# EAGLE design miniDCU main (EAGLE 9.6.2)
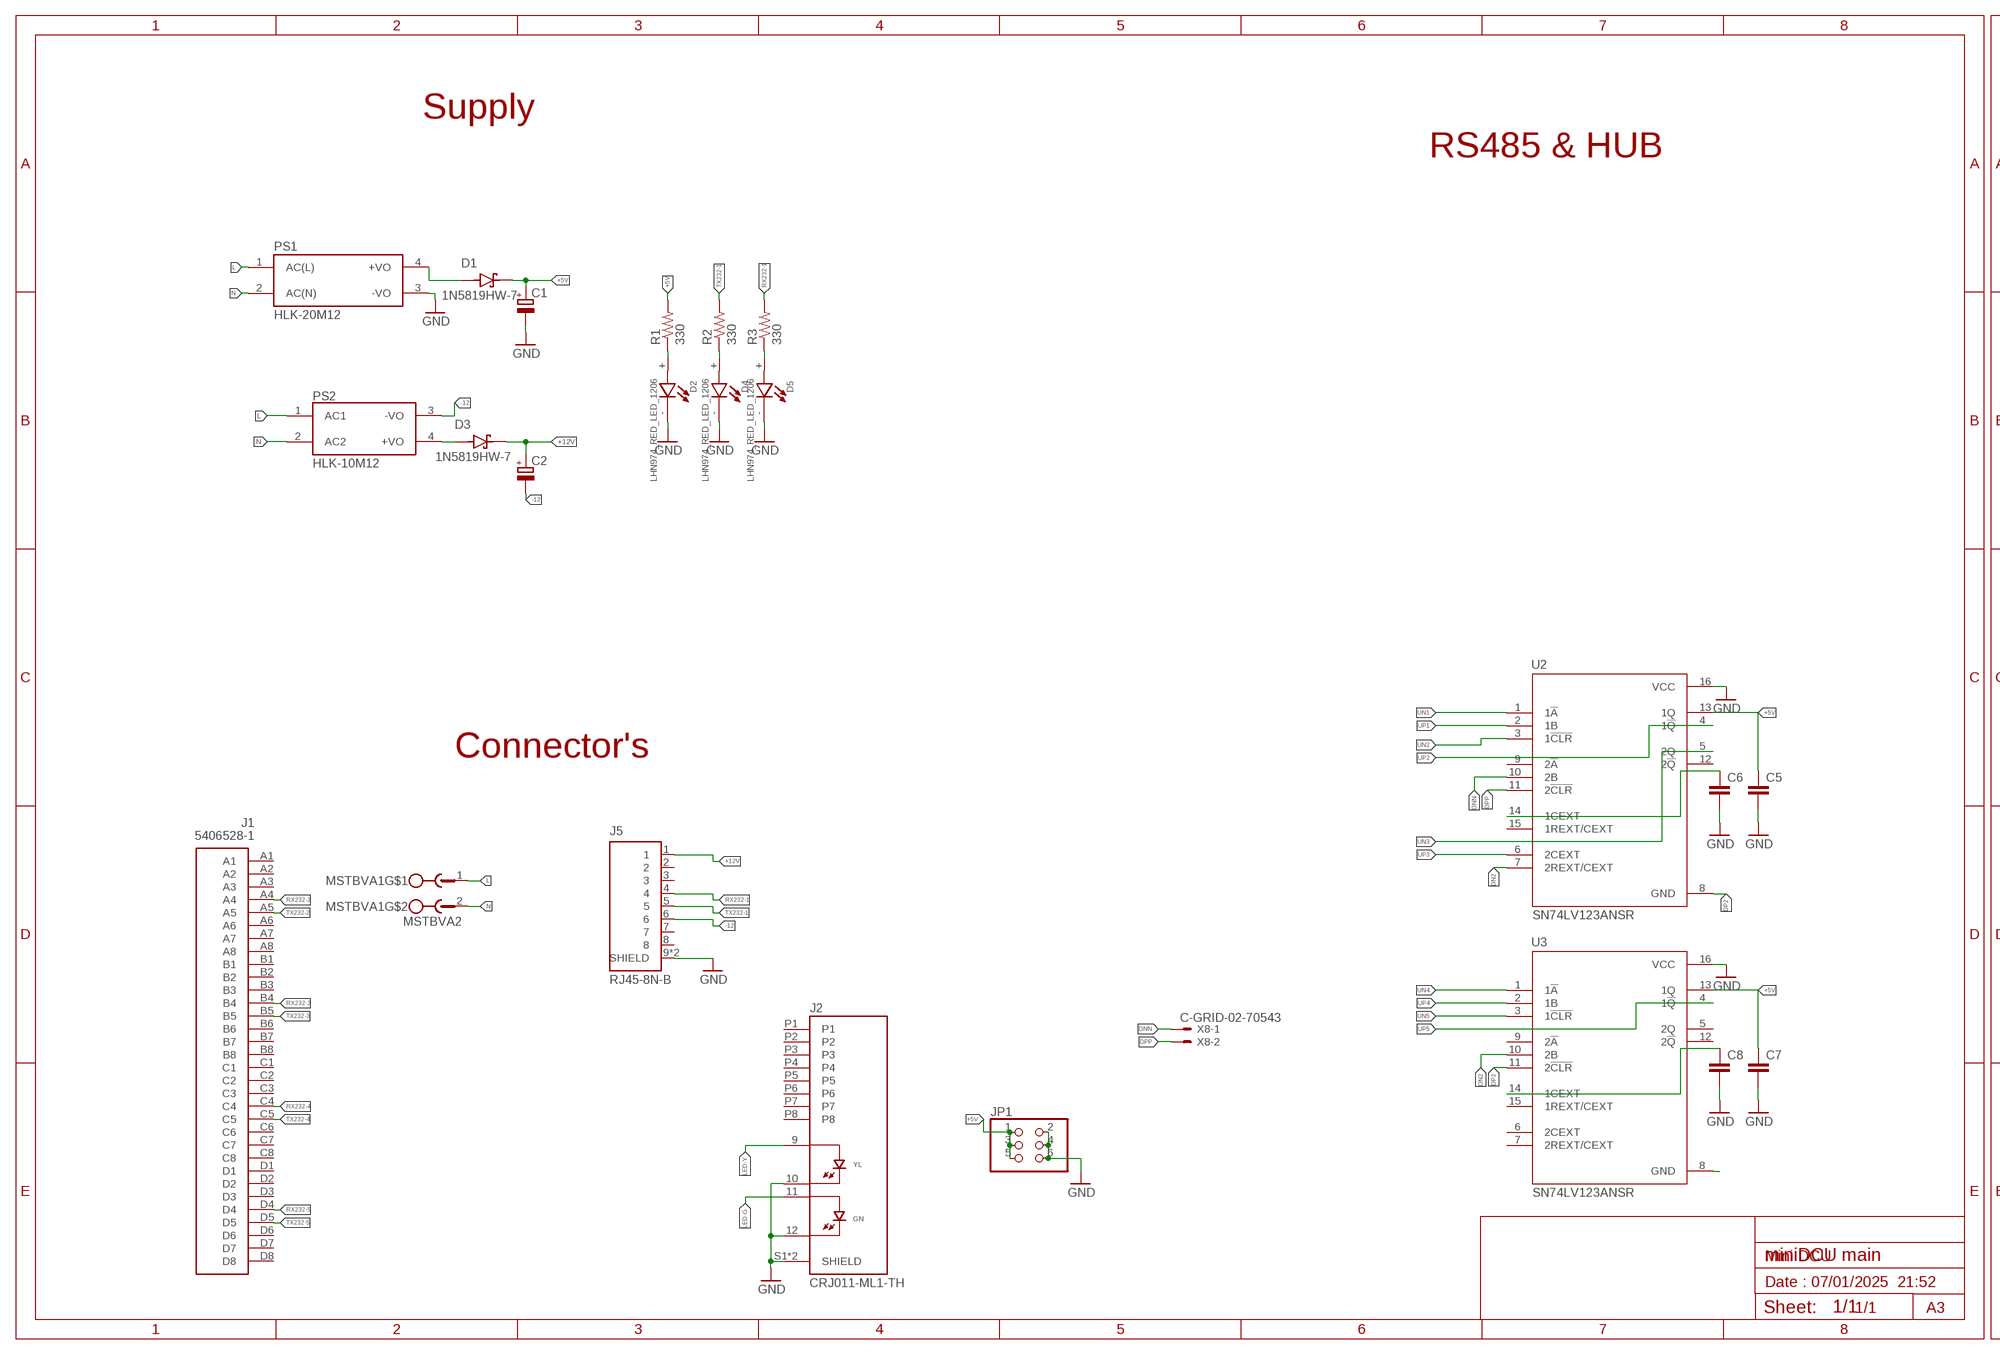
[diagram p0: schematic, sheet 1, part 1 of 2]
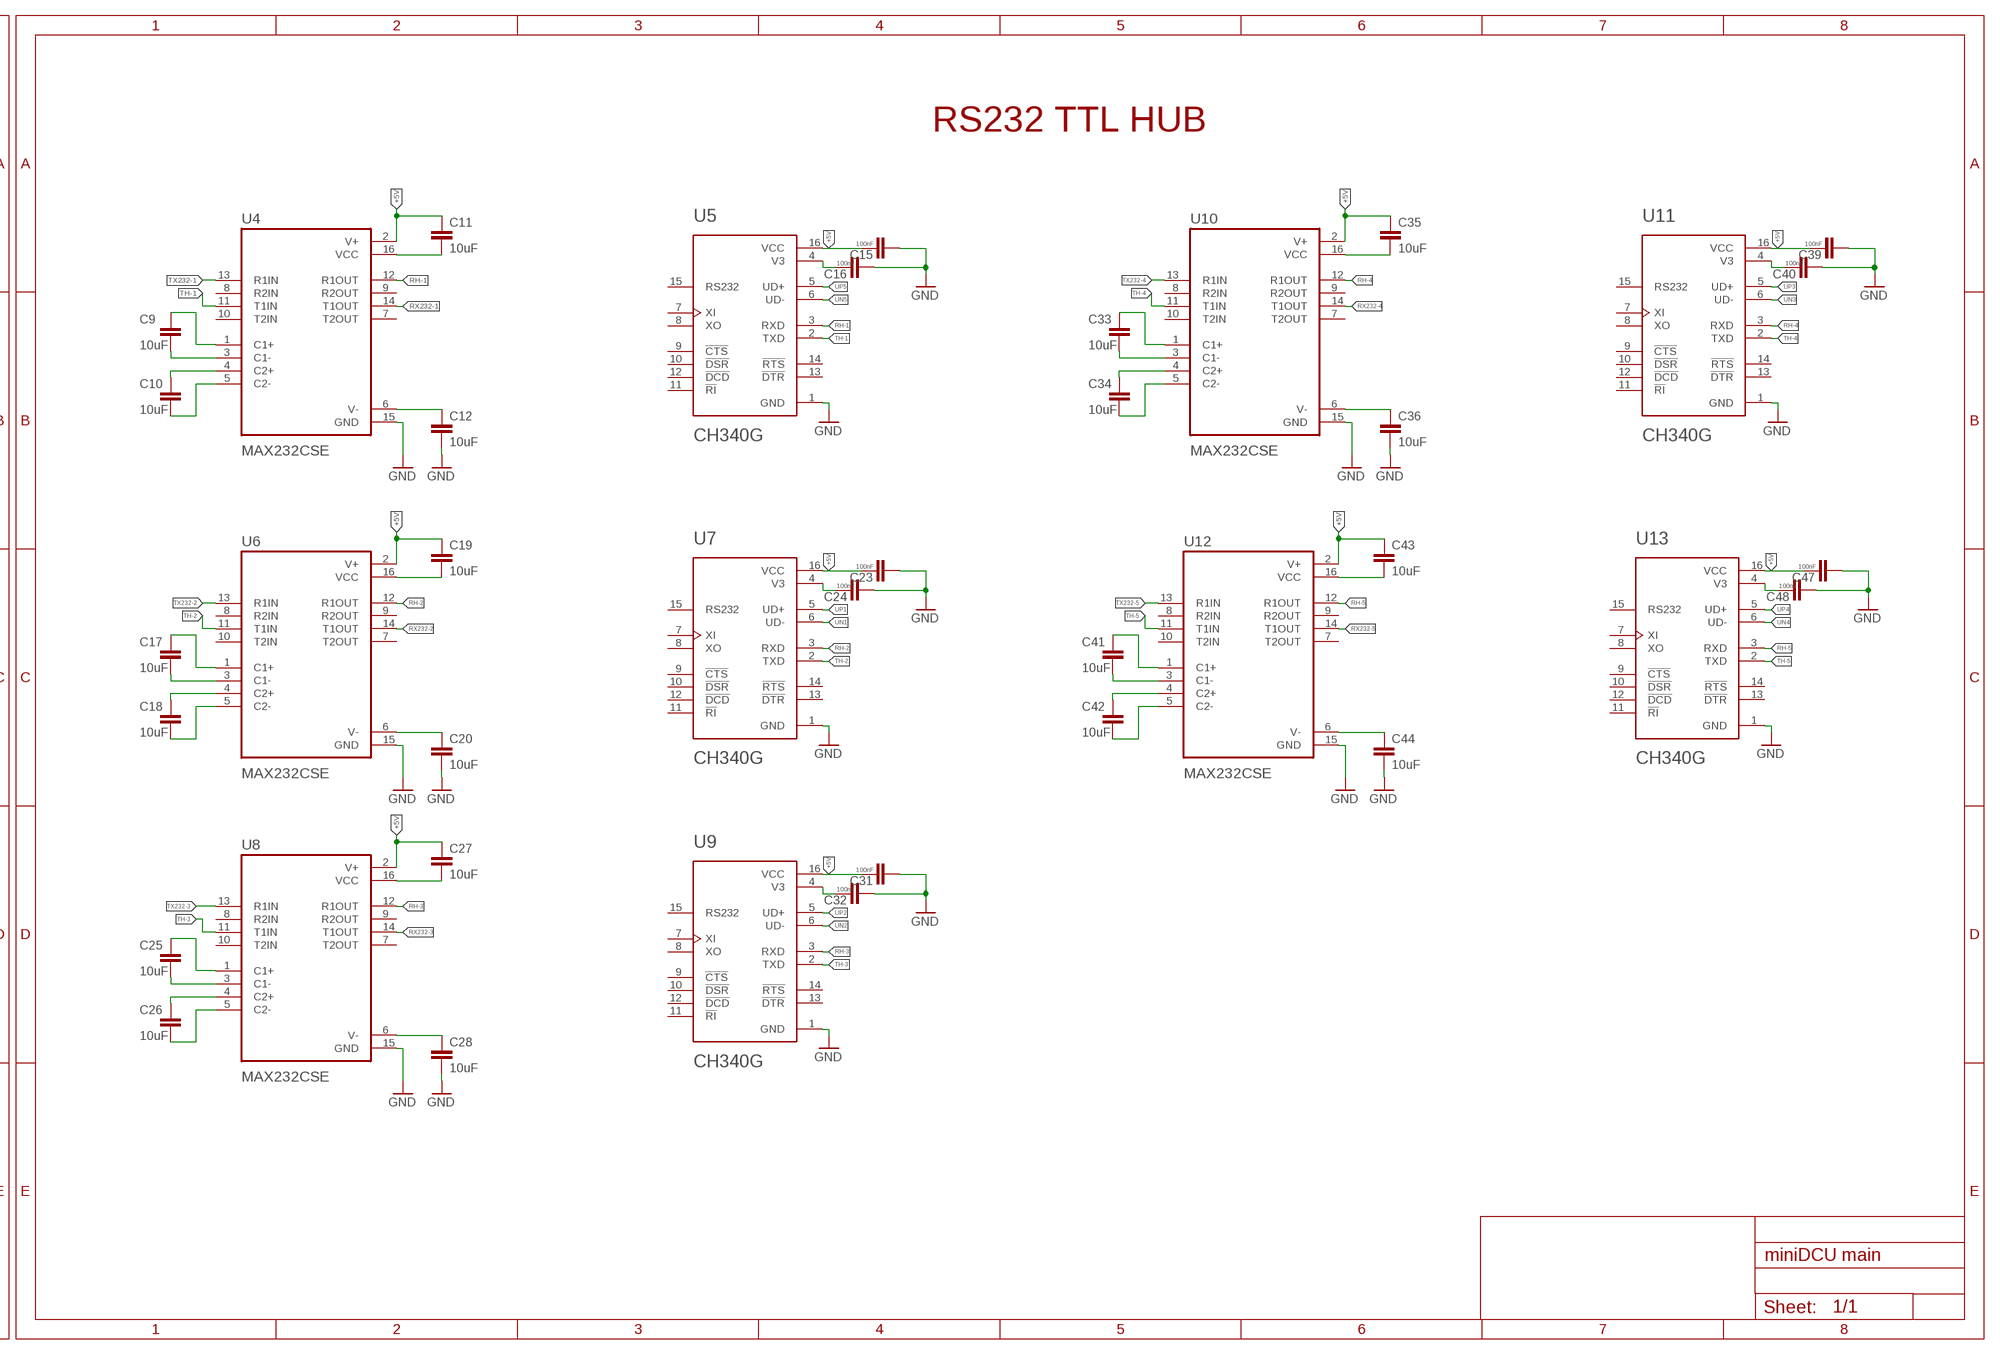
[diagram p1: schematic, sheet 1, part 2 of 2]

## Parts
C1  CPOL-EU153CLV-0505  [153CLV-0505]
C2  CPOL-EU153CLV-0505  [153CLV-0505]
C5  C-EUC0603K  [C0603K]
C6  C-EUC0603K  [C0603K]
C7  C-EUC0603K  [C0603K]
C8  C-EUC0603K  [C0603K]
C9  10uF  C-EUC0805  [C0805]
C10  10uF  C-EUC0805  [C0805]
C11  10uF  C-EUC0805  [C0805]
C12  10uF  C-EUC0805  [C0805]
C15  100nF  C-EUC0805K  [C0805K]
C16  100nF  C-EUC0805K  [C0805K]
C17  10uF  C-EUC0805  [C0805]
C18  10uF  C-EUC0805  [C0805]
C19  10uF  C-EUC0805  [C0805]
C20  10uF  C-EUC0805  [C0805]
C23  100nF  C-EUC0805K  [C0805K]
C24  100nF  C-EUC0805K  [C0805K]
C25  10uF  C-EUC0805  [C0805]
C26  10uF  C-EUC0805  [C0805]
C27  10uF  C-EUC0805  [C0805]
C28  10uF  C-EUC0805  [C0805]
C31  100nF  C-EUC0805K  [C0805K]
C32  100nF  C-EUC0805K  [C0805K]
C33  10uF  C-EUC0805  [C0805]
C34  10uF  C-EUC0805  [C0805]
C35  10uF  C-EUC0805  [C0805]
C36  10uF  C-EUC0805  [C0805]
C39  100nF  C-EUC0805K  [C0805K]
C40  100nF  C-EUC0805K  [C0805K]
C41  10uF  C-EUC0805  [C0805]
C42  10uF  C-EUC0805  [C0805]
C43  10uF  C-EUC0805  [C0805]
C44  10uF  C-EUC0805  [C0805]
C47  100nF  C-EUC0805K  [C0805K]
C48  100nF  C-EUC0805K  [C0805K]
D1  1N5819HW-7  [SOD3715X145N]
D2  LHN974_RED_LED_1206  [LEDC3216X120N]
D3  1N5819HW-7  [SOD3715X145N]
D4  LHN974_RED_LED_1206  [LEDC3216X120N]
D5  LHN974_RED_LED_1206  [LEDC3216X120N]
J1  5406528-1  [5406528-1]
J2  CRJ011-ML1-TH  [CUI_CRJ011-ML1-TH]
J5  RJ45-8N-B  [TE_RJ45-8N-B]
JP1  PINHD-2X3  [2X03]
MSTBVA1  MSTBVA2  [MSTBVA2]
PS1  HLK-20M12  [CONV_HLK-20M12]
PS2  HLK-10M12  [CONV_HLK-10M12]
R1  330  R-US_M0805  [M0805]
R2  330  R-US_M0805  [M0805]
R3  330  R-US_M0805  [M0805]
U2  SN74LV123ANSR  [SOIC127P780X200-16N]
U3  SN74LV123ANSR  [SOIC127P780X200-16N]
U4  MAX232CSE  [SOIC127P600X175-16N]
U5  CH340G  [SOIC127P600X180-16N]
U6  MAX232CSE  [SOIC127P600X175-16N]
U7  CH340G  [SOIC127P600X180-16N]
U8  MAX232CSE  [SOIC127P600X175-16N]
U9  CH340G  [SOIC127P600X180-16N]
U10  MAX232CSE  [SOIC127P600X175-16N]
U11  CH340G  [SOIC127P600X180-16N]
U12  MAX232CSE  [SOIC127P600X175-16N]
U13  CH340G  [SOIC127P600X180-16N]
X8  C-GRID-02-70543  [70543-02]

## Nets
+5V: C1.+ C5.1 C7.1 C11.1 C15.1 C19.1 C23.1 C27.1 C31.1 C35.1 C39.1 C43.1 C47.1 D1.C(K) JP1.1 JP1.3 JP1.5 R1.2 U2.13(1Q) U3.13(1Q) U4.2(V+) U5.16(VCC) U6.2(V+) U7.16(VCC) U8.2(V+) U9.16(VCC) U10.2(V+) U11.16(VCC) U12.2(V+) U13.16(VCC)
+12V: C2.+ D3.C(K) J5.1
-12: C2.- J5.6 PS2.3(-VO)
DN2: U2.7(2REXT/CEXT) U3.10(2B)
DNN: U2.10(2B) X8.1
DP2: U2.8(GND) U3.11(2!CLR)
DPP: U2.11(2!CLR) X8.2
GND: C1.- C5.2 C6.2 C7.2 C8.2 C12.2 C15.2 C16.2 C20.2 C23.2 C24.2 C28.2 C31.2 C32.2 C36.2 C39.2 C40.2 C44.2 C47.2 C48.2 D2.- D4.- D5.- J2.10 J2.12 J2.S1(SHIELD) J2.S2(SHIELD) J5.9(SHIELD) J5.10(SHIELD) JP1.2 JP1.4 JP1.6 PS1.3(-VO) U2.16(VCC) U3.16(VCC) U4.15(GND) U5.1(GND) U6.15(GND) U7.1(GND) U8.15(GND) U9.1(GND) U10.15(GND) U11.1(GND) U12.15(GND) U13.1(GND)
L: MSTBVA1.1 PS1.1(AC(L)) PS2.1(AC1)
LED-G: J2.11
LED-Y: J2.9
N: MSTBVA1.2 PS1.2(AC(N)) PS2.2(AC2)
N$1: D1.A PS1.4(+VO)
N$2: D4.+ R2.1
N$3: D2.+ R1.1
N$4: D5.+ R3.1
N$8: D3.A PS2.4(+VO)
N$13: U3.8(GND)
N$14: C9.2 U4.3(C1-)
N$15: C9.1 U4.1(C1+)
N$16: C10.1 U4.4(C2+)
N$17: C10.2 U4.5(C2-)
N$18: C11.2 U4.16(VCC)
N$19: C12.1 U4.6(V-)
N$27: C16.1 U5.4(V3)
N$29: C17.2 U6.3(C1-)
N$30: C17.1 U6.1(C1+)
N$31: C18.1 U6.4(C2+)
N$32: C18.2 U6.5(C2-)
N$33: C19.2 U6.16(VCC)
N$34: C20.1 U6.6(V-)
N$39: C24.1 U7.4(V3)
N$41: C25.2 U8.3(C1-)
N$42: C25.1 U8.1(C1+)
N$43: C26.1 U8.4(C2+)
N$44: C26.2 U8.5(C2-)
N$45: C27.2 U8.16(VCC)
N$46: C28.1 U8.6(V-)
N$49: C32.1 U9.4(V3)
N$51: C33.2 U10.3(C1-)
N$52: C33.1 U10.1(C1+)
N$53: C34.1 U10.4(C2+)
N$55: C8.1 U3.14(1CEXT)
N$56: C34.2 U10.5(C2-)
N$57: C35.2 U10.16(VCC)
N$58: C36.1 U10.6(V-)
N$61: C6.1 U2.14(1CEXT)
N$62: C40.1 U11.4(V3)
N$64: C41.2 U12.3(C1-)
N$65: C41.1 U12.1(C1+)
N$66: C42.1 U12.4(C2+)
N$67: C42.2 U12.5(C2-)
N$68: C43.2 U12.16(VCC)
N$69: C44.1 U12.6(V-)
N$72: C48.1 U13.4(V3)
RH-1: U4.12(R1OUT) U5.3(RXD)
RH-2: U6.12(R1OUT) U7.3(RXD)
RH-3: U8.12(R1OUT) U9.3(RXD)
RH-4: U10.12(R1OUT) U11.3(RXD)
RH-5: U12.12(R1OUT) U13.3(RXD)
RX232-1: J5.4 R3.2 U4.14(T1OUT)
RX232-2: J1.A4 U6.14(T1OUT)
RX232-3: J1.B4 U8.14(T1OUT)
RX232-4: J1.C4 U10.14(T1OUT)
RX232-5: J1.D4 U12.14(T1OUT)
TH-1: U4.11(T1IN) U5.2(TXD)
TH-2: U6.11(T1IN) U7.2(TXD)
TH-3: U8.11(T1IN) U9.2(TXD)
TH-4: U10.11(T1IN) U11.2(TXD)
TH-5: U12.11(T1IN) U13.2(TXD)
TX232-1: J5.5 R2.2 U4.13(R1IN)
TX232-2: J1.A5 U6.13(R1IN)
TX232-3: J1.B5 U8.13(R1IN)
TX232-4: J1.C5 U10.13(R1IN)
TX232-5: J1.D5 U12.13(R1IN)
UN1: U2.1(1!A) U7.6(UD-)
UN2: U2.3(1!CLR) U9.6(UD-)
UN3: U2.5(2Q) U11.6(UD-)
UN4: U3.1(1!A) U13.6(UD-)
UN5: U3.3(1!CLR) U5.6(UD-)
UP1: U2.2(1B) U7.5(UD+)
UP2: U2.4(1!Q) U9.5(UD+)
UP3: U2.6(2CEXT) U11.5(UD+)
UP4: U3.2(1B) U13.5(UD+)
UP5: U3.4(1!Q) U5.5(UD+)
Unconnected: J1.A1 J1.A2 J1.A3 J1.A6 J1.A7 J1.A8 J1.B1 J1.B2 J1.B3 J1.B6 J1.B7 J1.B8 J1.C1 J1.C2 J1.C3 J1.C6 J1.C7 J1.C8 J1.D1 J1.D2 J1.D3 J1.D6 J1.D7 J1.D8 J2.P1 J2.P2 J2.P3 J2.P4 J2.P5 J2.P6 J2.P7 J2.P8 J5.2 J5.3 J5.7 J5.8 U2.9(2!A) U2.12(2!Q) U2.15(1REXT/CEXT) U3.5(2Q) U3.6(2CEXT) U3.7(2REXT/CEXT) U3.9(2!A) U3.12(2!Q) U3.15(1REXT/CEXT) U4.7(T2OUT) U4.8(R2IN) U4.9(R2OUT) U4.10(T2IN) U5.7(XI) U5.8(XO) U5.9(!CTS) U5.10(!DSR) U5.11(!RI) U5.12(!DCD) U5.13(!DTR) U5.14(!RTS) U5.15(RS232) U6.7(T2OUT) U6.8(R2IN) U6.9(R2OUT) U6.10(T2IN) U7.7(XI) U7.8(XO) U7.9(!CTS) U7.10(!DSR) U7.11(!RI) U7.12(!DCD) U7.13(!DTR) U7.14(!RTS) U7.15(RS232) U8.7(T2OUT) U8.8(R2IN) U8.9(R2OUT) U8.10(T2IN) U9.7(XI) U9.8(XO) U9.9(!CTS) U9.10(!DSR) U9.11(!RI) U9.12(!DCD) U9.13(!DTR) U9.14(!RTS) U9.15(RS232) U10.7(T2OUT) U10.8(R2IN) U10.9(R2OUT) U10.10(T2IN) U11.7(XI) U11.8(XO) U11.9(!CTS) U11.10(!DSR) U11.11(!RI) U11.12(!DCD) U11.13(!DTR) U11.14(!RTS) U11.15(RS232) U12.7(T2OUT) U12.8(R2IN) U12.9(R2OUT) U12.10(T2IN) U13.7(XI) U13.8(XO) U13.9(!CTS) U13.10(!DSR) U13.11(!RI) U13.12(!DCD) U13.13(!DTR) U13.14(!RTS) U13.15(RS232)

## Notes on the sheet
- Supply
- RS232 TTL HUB
- RS485 & HUB
- Connector's
- Mini DCU
- Date : 07/01/2025  21:52
- 1/1 | A3

## Library data of the parts
C1 C2 = rcl:CPOL-EU: POLARIZED CAPACITOR, European symbol; SPICEPREFIX: C
C5-C12 C15-C20 C23-C28 C31-C36 C39-C44 C47 C48 = rcl:C-EU: CAPACITOR, European symbol; SPICEPREFIX: C
D1 D3 = 1N5819HW-7:1N5819HW-7: 1N5819HW Series 40 V 1 A Surface Mount Schottky Barrier Rectifier - SOD-123 Check availability <https://pricing.snapeda.com/parts/1N5819HW-7/Diodes%20Inc./view-part?ref=eda>; AVAILABILITY: In Stock; DESCRIPTION: Diode Schottky 40 V 1A Surface Mount SOD-123; MF: Diodes Inc.; MP: 1N5819HW-7; PACKAGE: SOD-123 Fairchild Semiconductor; PRICE: None; PURCHASE-URL: https://pricing.snapeda.com/search/part/1N5819HW-7/?ref=eda
D2 D4 D5 = LHN974_RED_LED_1206:LHN974_RED_LED_1206: Check availability <https://pricing.snapeda.com/parts/LHN974%20RED%20LED%201206/Osram/view-part?ref=eda>; AVAILABILITY: Not in stock; CHECK_PRICES: https://www.snapeda.com/parts/LHN974%20RED%20LED%201206/Osram/view-part/?ref=eda; DESCRIPTION: 2.6 V Red LED SMD; MF: Osram; MP: LHN974 RED LED 1206; PACKAGE: None; PRICE: None; SNAPEDA_LINK: https://www.snapeda.com/parts/LHN974%20RED%20LED%201206/Osram/view-part/?ref=snap
J1 = 1x4-rj45:5406528-1: https://www.mouser.com/ProductDetail/TE-Connectivity/5406528-1?qs=%2Fha2pyFaduhW1yoX2fqnO8wde0gPlB9ihmIbWroxuIA%3D Check availability <https://pricing.snapeda.com/parts/5406528-1/TE%20Connectivity/view-part?ref=eda>; AVAILABILITY: In Stock; CHECK_PRICES: https://www.snapeda.com/parts/5406528-1/TE+Connectivity+AMP+Connectors/view-part/?ref=eda; COMMENT: 5406528-1; DESCRIPTION: Conn RJ-45 F 32 POS 2.04mm Solder RA Thru-Hole 32 Terminal 4 Port Tray Cat 5; EU_ROHS_COMPLIANCE: Compliant; MF: TE Connectivity; MP: 5406528-1; PACKAGE: None; PRICE: None; SNAPEDA_LINK: https://www.snapeda.com/parts/5406528-1/TE+Connectivity+AMP+Connectors/view-part/?ref=snap
J2 = CRJ011-ML1-TH:CRJ011-ML1-TH: Check availability <https://pricing.snapeda.com/parts/CRJ011-ML1-TH/Same%20Sky/view-part?ref=eda>; AVAILABILITY: In Stock; CHECK_PRICES: https://www.snapeda.com/parts/CRJ011-ML1-TH/Same+Sky/view-part/?ref=eda; DESCRIPTION: 10/100 BaseT, 8P8C, Horizontal, Shielded, LED, Through Hole, 6 µin Plating, RJ45 with Integrated Magnetics Modular Connector; MF: Same Sky; MP: CRJ011-ML1-TH; PACKAGE: None; PRICE: None; SNAPEDA_LINK: https://www.snapeda.com/parts/CRJ011-ML1-TH/Same+Sky/view-part/?ref=snap
J5 = RJ45-8N-B:RJ45-8N-B: RJ Jack / Signal Line EMI/RFI Filters 6 TERM LOW PROFILE BLOCK INDUCTOR 8 PIN Check availability <https://pricing.snapeda.com/parts/RJ45-8N-B/TE%20Connectivity/view-part?ref=eda>; AVAILABILITY: In Stock; DESCRIPTION: Jack Modular Connector 8p8c (RJ45, Ethernet) 90° Angle (Right) Unshielded -; MF: TE Connectivity; MP: RJ45-8N-B; PACKAGE: None; PRICE: None; PURCHASE-URL: https://pricing.snapeda.com/search/part/RJ45-8N-B/?ref=eda
JP1 = pinhead:PINHD-2X3: PIN HEADER
MSTBVA1 = con-phoenix-508:MSTBVA2
PS1 = HLK-20M12:HLK-20M12: Check availability <https://pricing.snapeda.com/parts/HLK-20M12/Hi-link/view-part?ref=eda>; AVAILABILITY: Not in stock; CHECK_PRICES: https://www.snapeda.com/parts/HLK-20M12/Hi-link/view-part/?ref=eda; DESCRIPTION: 20W ultra-small series module power supply; MF: Hi-link; MP: HLK-20M12; PACKAGE: Non-Standard Hi-link; PRICE: None; SNAPEDA_LINK: https://www.snapeda.com/parts/HLK-20M12/Hi-link/view-part/?ref=snap
PS2 = HLK-10M12:HLK-10M12: Check availability <https://pricing.snapeda.com/parts/HLK-10M12/Hi-link/view-part?ref=eda>; AVAILABILITY: Not in stock; CHECK_PRICES: https://www.snapeda.com/parts/HLK-10M12/Hi-link/view-part/?ref=eda; DESCRIPTION: 10W Ultra-Compact Power Module; MF: Hi-link; MP: HLK-10M12; PACKAGE: Package; PRICE: None; SNAPEDA_LINK: https://www.snapeda.com/parts/HLK-10M12/Hi-link/view-part/?ref=snap
R1-R3 = adafruit:R-US_: RESISTOR, American symbol
U2 U3 = SN74LV123ANSR:SN74LV123ANSR: Monostable Multivibrator 13ns 16-SO; CHECK_PRICES: https://www.snapeda.com/parts/SN74LV123ANSR/Texas+Instruments/view-part/?ref=eda; DESCRIPTION: Dual Retriggerable Monostable Multivibrators; DIGIKEY_PART_NUMBER: 296-46201-2-ND; MF: Texas Instruments; MP: SN74LV123ANSR; PACKAGE: SOP-16 Texas Instruments; SNAPEDA_LINK: https://www.snapeda.com/parts/SN74LV123ANSR/Texas+Instruments/view-part/?ref=snap
U4 U6 U8 U10 U12 = MAX232CSE:MAX232CSE: Check availability <https://pricing.snapeda.com/parts/MAX232CSE/Maxim%20Integrated/view-part?ref=eda>; AVAILABILITY: In Stock; DESCRIPTION: 2/2 Transceiver Full RS232 16-SOIC; MF: Maxim Integrated; MP: MAX232CSE; PACKAGE: SOIC-16 Maxim Integrated; PRICE: None; PURCHASE-URL: https://pricing.snapeda.com/search/part/MAX232CSE/?ref=eda
U5 U7 U9 U11 U13 = CH340G:CH340G: Check availability <https://pricing.snapeda.com/parts/Ch340G/WCH/view-part?ref=eda>; AVAILABILITY: Not in stock; DESCRIPTION: USB Interface Integrated Circuit; MF: WCH; MP: Ch340G; PACKAGE: None; PRICE: None
X8 = con-molex:C-GRID-02: CONNECTOR wire to board 2.54 mm (0.100") pitch header; MF: MOLEX; OC_FARNELL: unknown; OC_NEWARK: unknown

## Board
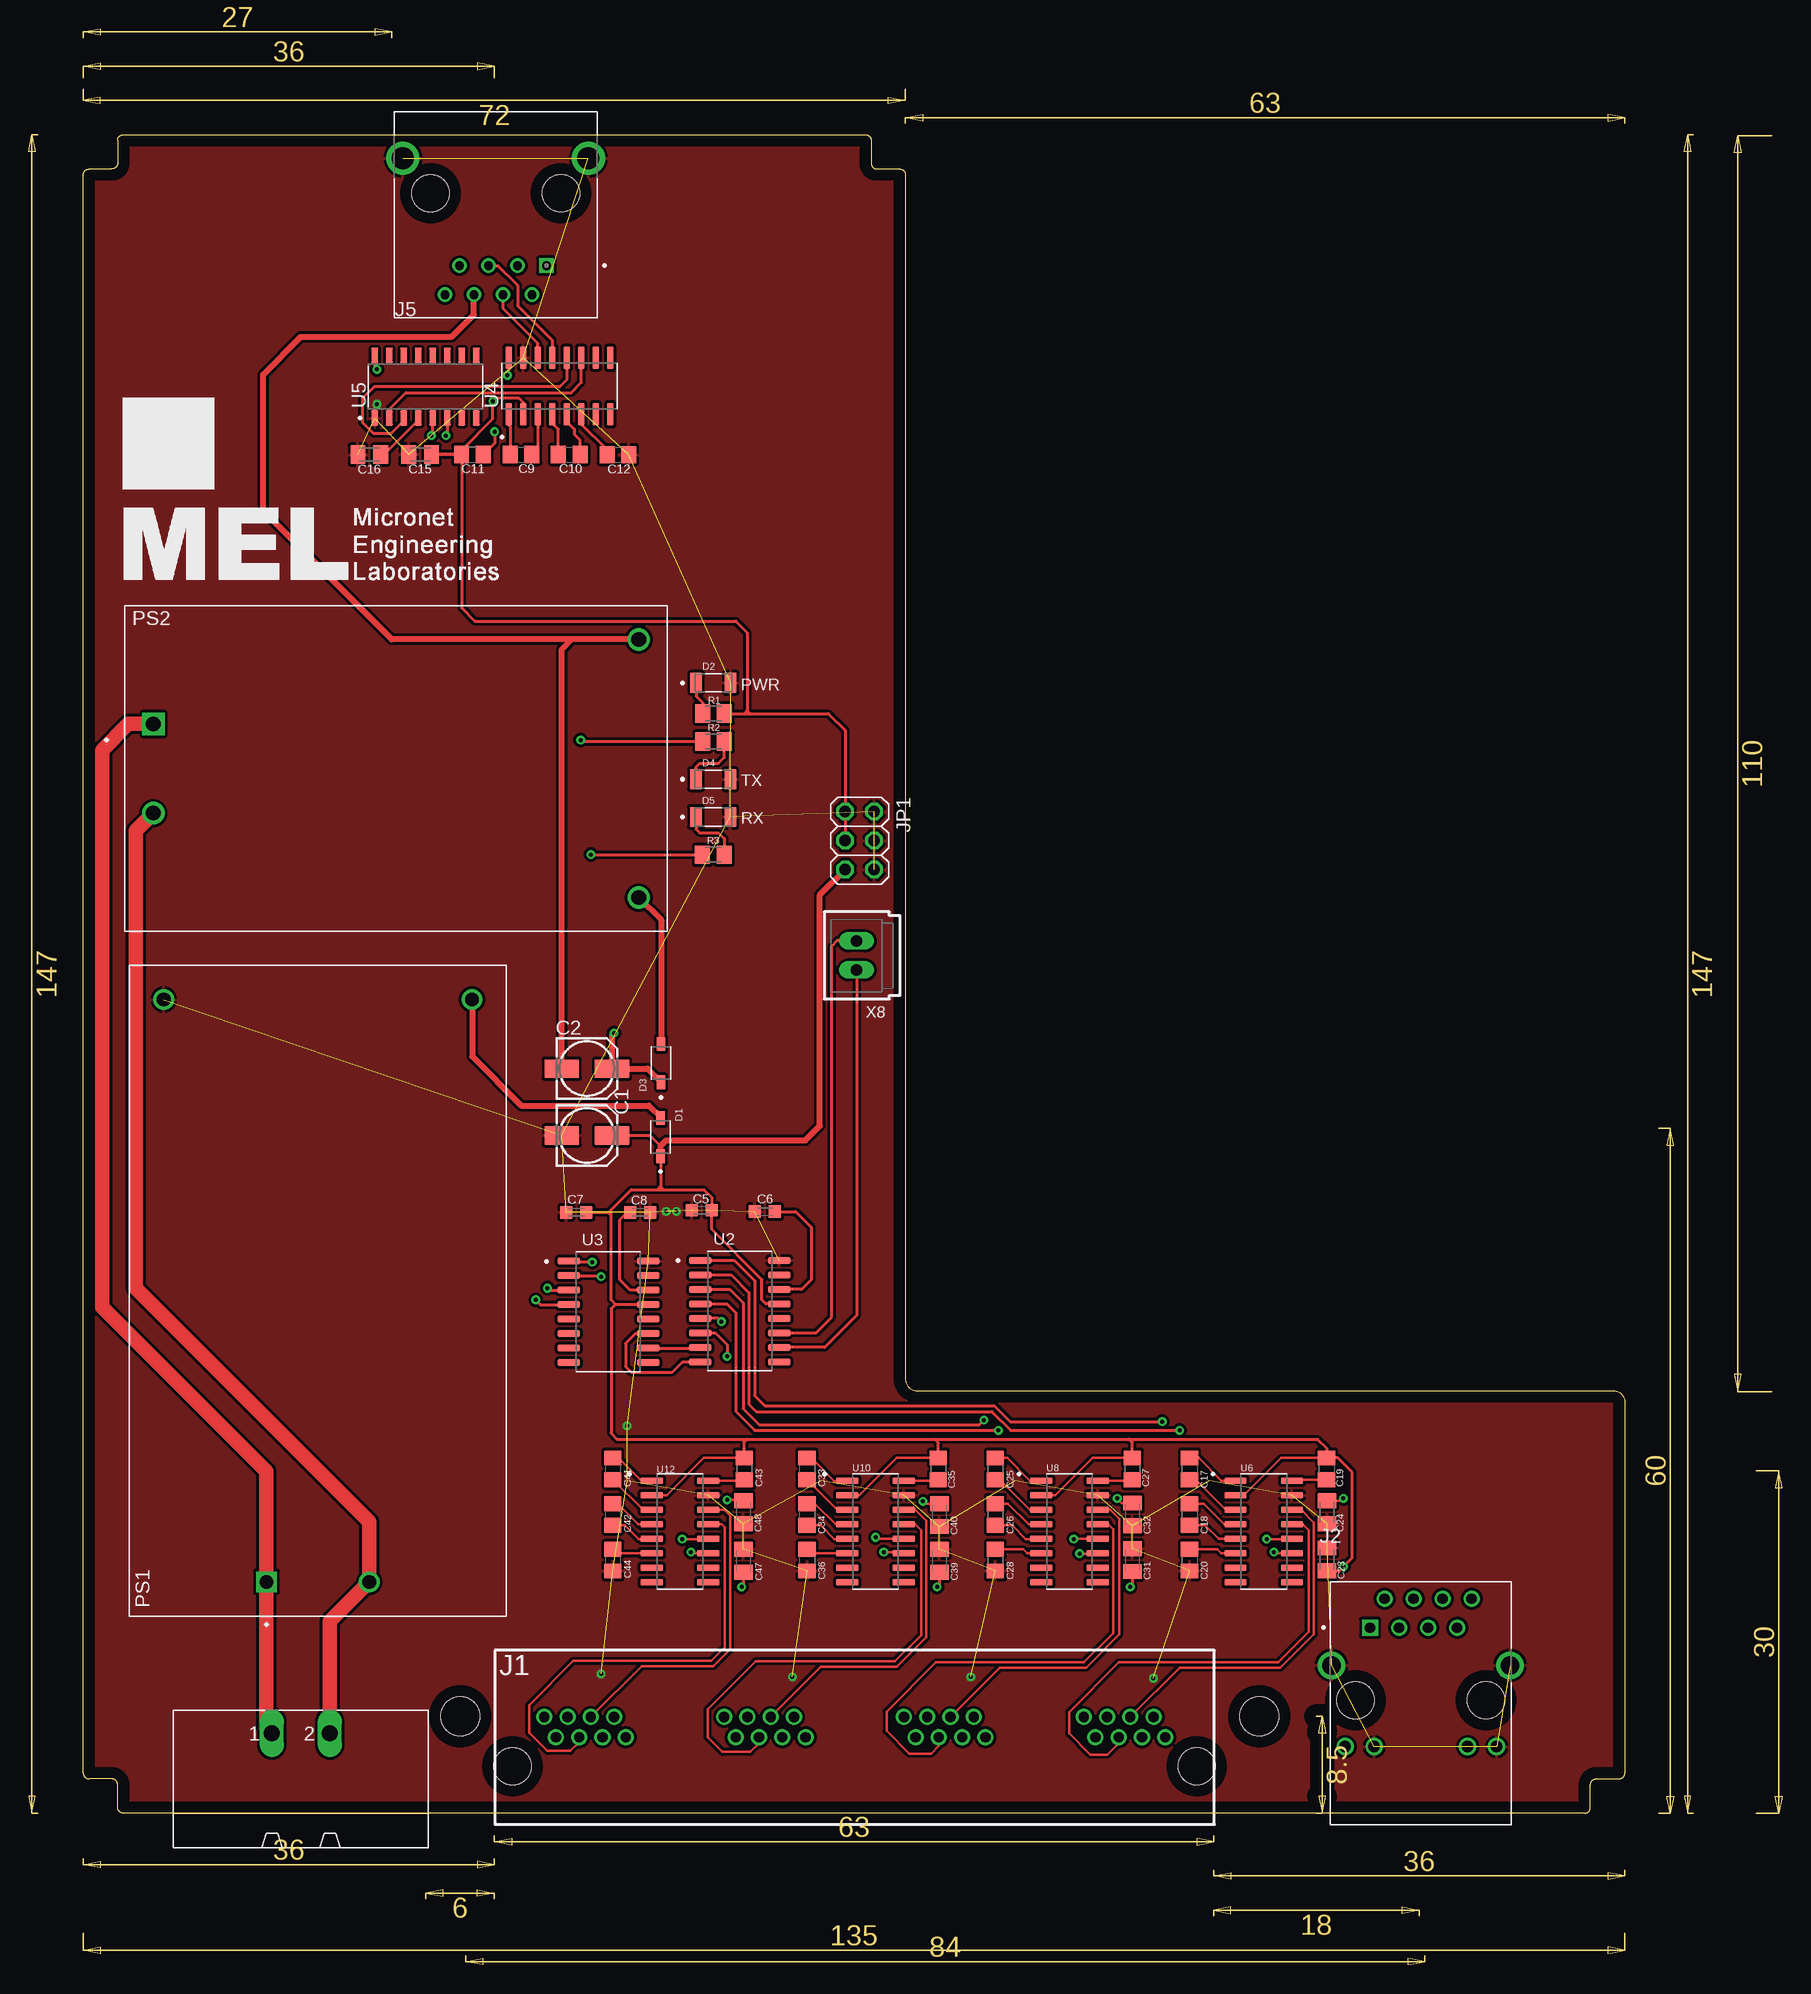
[diagram p2: board, top side]
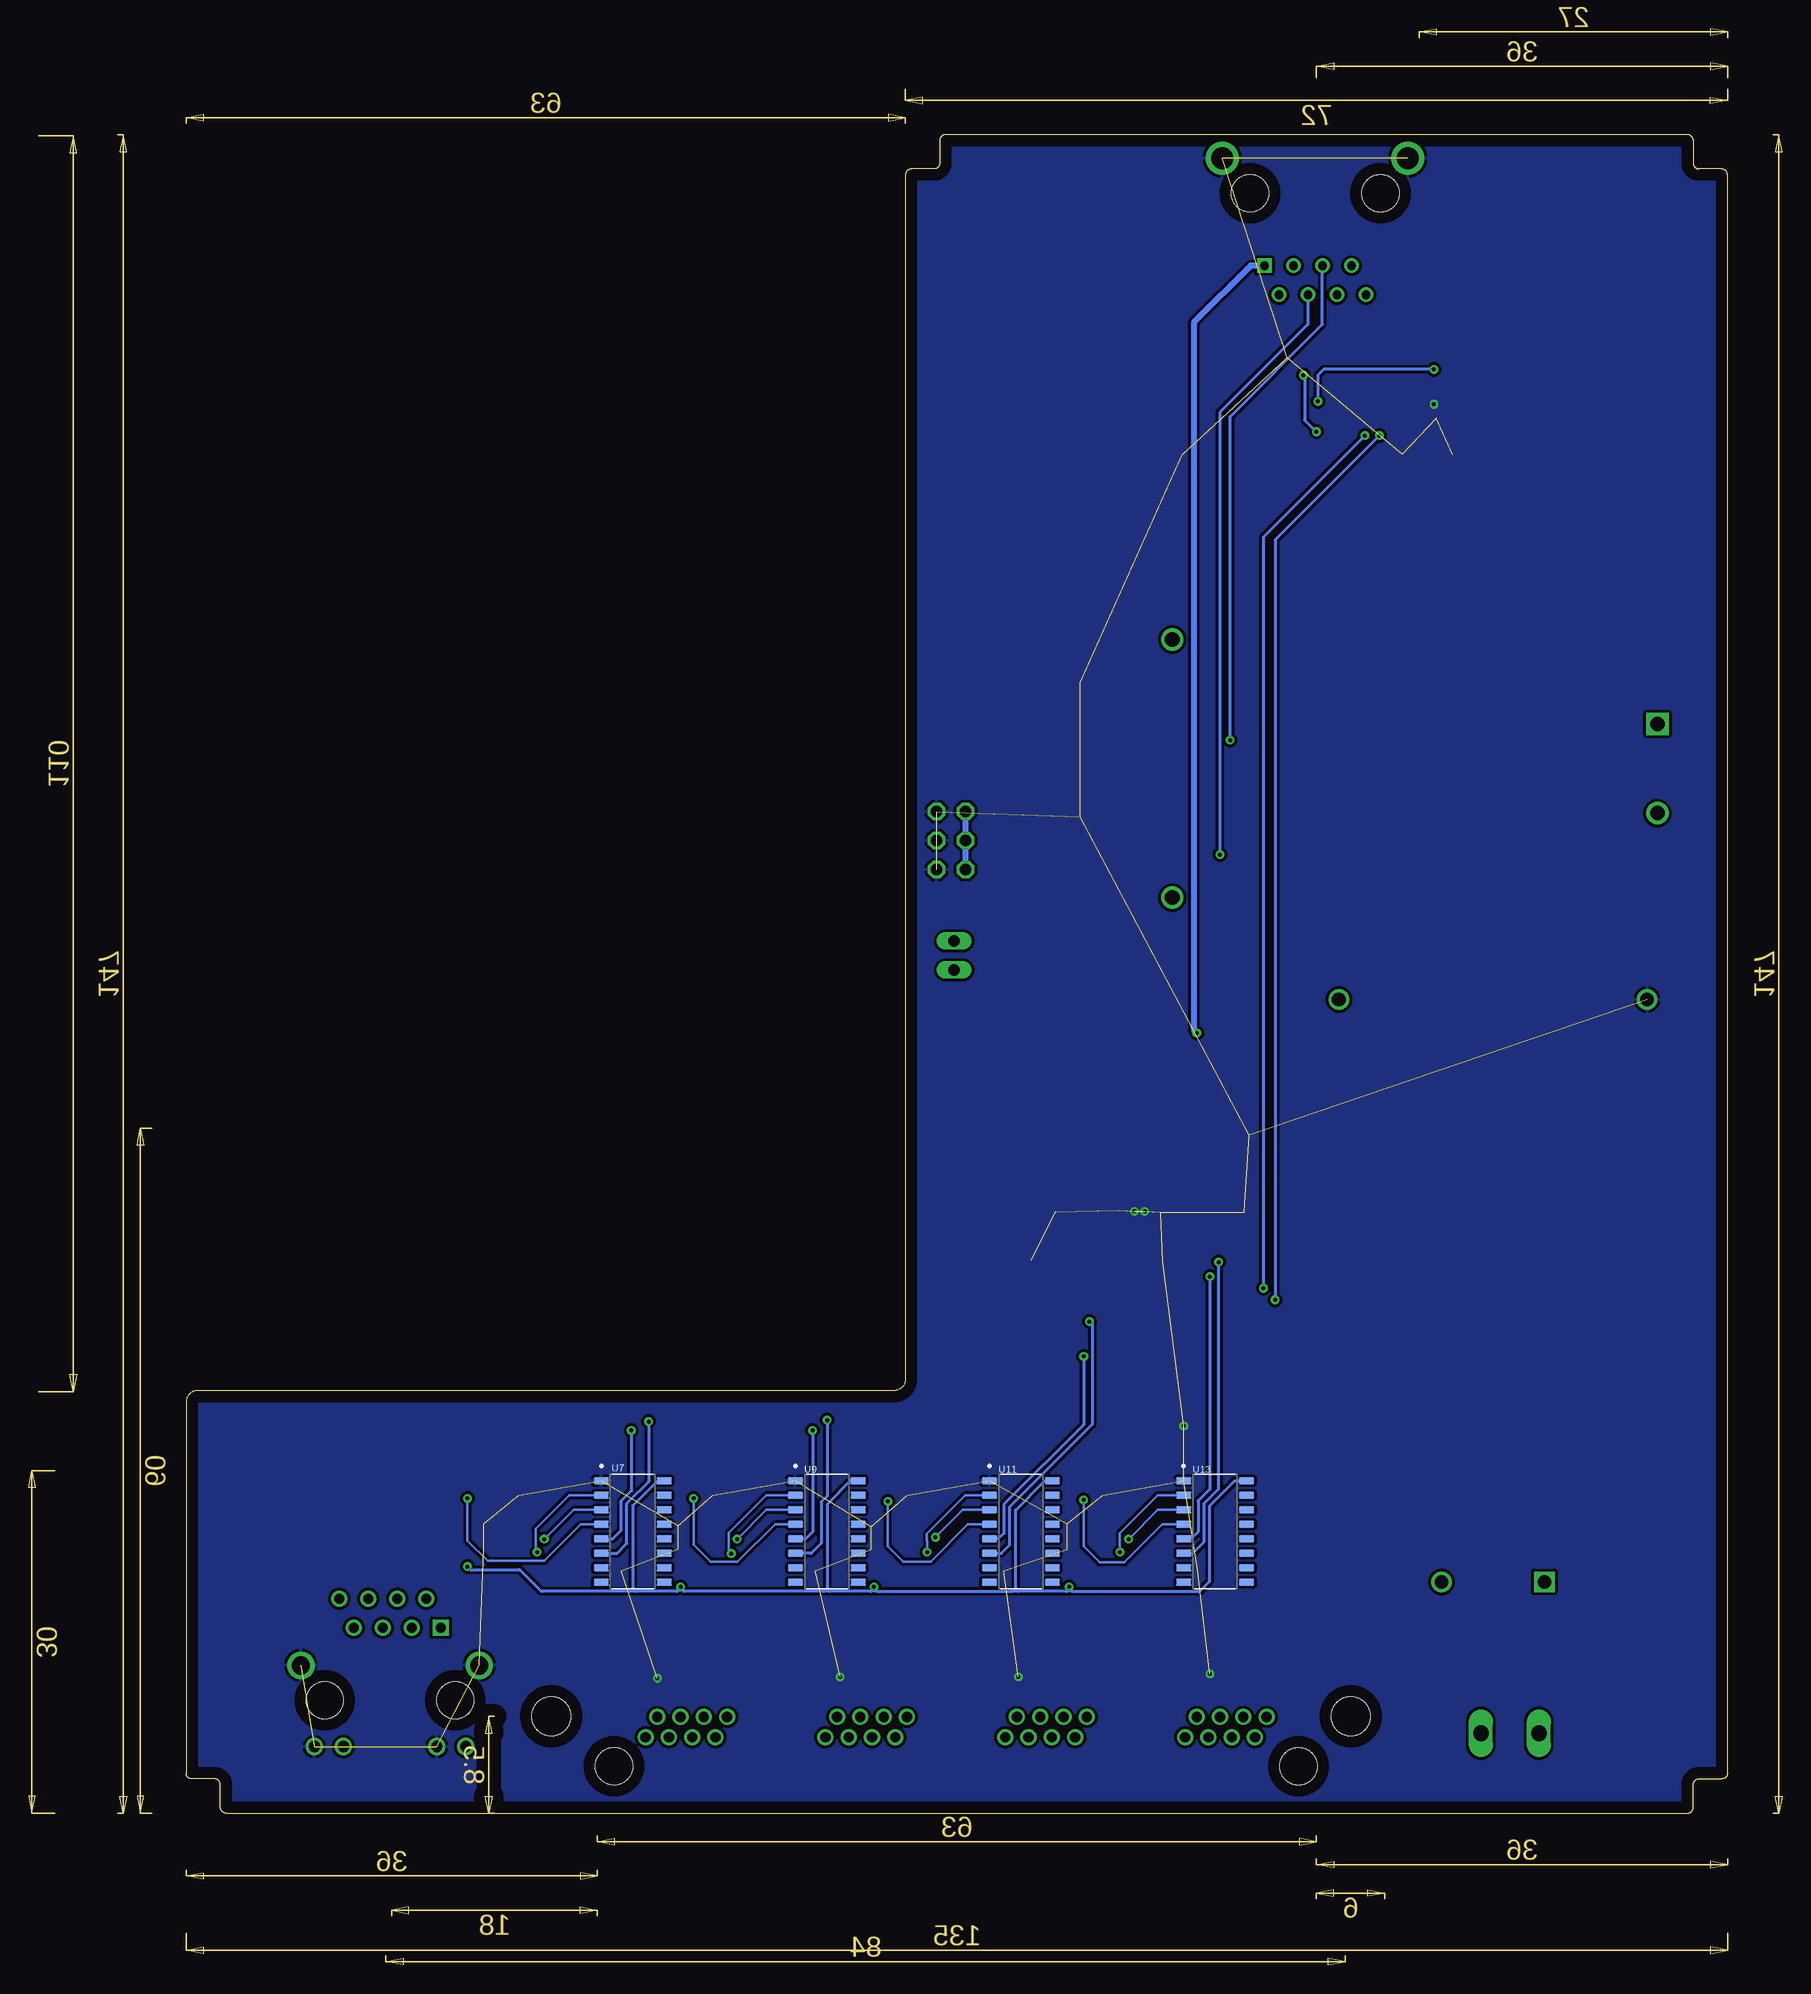
[diagram p3: board, bottom side, seen from below]

Size 135 x 147 mm. Coordinates in mm from the lower left corner, seen from the top.
Outline: 0,3.5 0,143.5 arc-90 0.5,144 2.5,144 arc90 3,144.5 3,146.5 arc-90 3.5,147 68.5,147 arc-90 69,146.5 69,144.5 arc90 69.5,144 71.5,144 arc-90 72,143.5 72,38 arc90 73,37 134,37 arc-90 135,36 135,3.5 arc-90 134.5,3 132.5,3 arc90 132,2.5 132,0.5 arc-90 131.5,0 3.5,0 arc-90 3,0.5 3,2.5 arc90 2.5,3 0.5,3 arc-90 0,3.5
Copper layers (1*16): Top 0.035mm / dielectric 1.5mm / Bottom 0.035mm
Design rules "miniDCU *": minimum track width 6mil, minimum drill 0.35mm, track to track 10mil, track to pad 10mil, pad to pad 0.205mm, via to via 0.205mm, smd to smd 6mil, copper to edge 40mil, drill to drill 6mil, minimum pad ring 10mil, minimum via ring 8mil, stop-mask expansion 4mil, vias tented up to drill 0mil, thermal gap 10mil
Holes 3.4 mm at 33,8.5 103,8.5

### Footprints (pad centres in the part's own frame; a part is rotated, then mirrored left to right if it is on the bottom)
153CLV-0505 = smd 3 x 1.6: + 2.2,0; - -2.2,0
C0603K = smd 1.05 x 1.08: 1 -0.875,0; 2 0.875,0
C0805 = smd 1.3 x 1.5: 1 -0.95,0; 2 0.95,0
C0805K = smd 1.3 x 1.6: 1 -1,0; 2 1,0
SOD3715X145N = smd 1.21 x 0.73: A 1.68,0; C -1.68,0
LEDC3216X120N = smd 1.01 x 1.73: + -1.51,0; - 1.51,0
5406528-1 = drill 0.9 pad 1.3: A1 27.21,7.62; A2 26.19,9.4; A3 25.17,7.62; A4 24.15,9.4; A5 23.13,7.62; A6 22.11,9.4; A7 21.09,7.62; A8 20.07,9.4; B1 11.46,7.62; B2 10.44,9.4; B3 9.42,7.62; B4 8.4,9.4; B5 7.38,7.62; B6 6.36,9.4; B7 5.34,7.62; B8 4.32,9.4; C1 -4.29,7.62; C2 -5.31,9.4; C3 -6.33,7.62; C4 -7.35,9.4; C5 -8.37,7.62; C6 -9.39,9.4; C7 -10.41,7.62; C8 -11.43,9.4; D1 -20.04,7.62; D2 -21.06,9.4; D3 -22.08,7.62; D4 -23.1,9.4; D5 -24.12,7.62; D6 -25.14,9.4; D7 -26.16,7.62; D8 -27.18,9.4 | hole 3.25: -29.97,5.08; 29.97,5.08
CUI_CRJ011-ML1-TH = drill 1: 9 -6.63,-4.06; 10 -4.09,-4.06; 11 4.09,-4.06; 12 6.63,-4.06 | drill 0.9 square: P1 -4.445,6.35 | drill 0.9: P2 -3.175,8.89; P3 -1.905,6.35; P4 -0.635,8.89; P5 0.635,6.35; P6 1.905,8.89; P7 3.175,6.35; P8 4.445,8.89 | drill 1.6: S1 -7.815,3.05; S2 7.815,3.05 | hole 3.25: -5.715,0; 5.715,0
TE_RJ45-8N-B = drill 0.76 square: 1 -4.445,6.35 | drill 0.76: 2 -3.175,8.89; 3 -1.905,6.35; 4 -0.635,8.89; 5 0.635,6.35; 6 1.905,8.89; 7 3.175,6.35; 8 4.445,8.89 | drill 1.93: 9 -8.125,-3.05; 10 8.125,-3.05 | hole 3.25: -5.715,0; 5.715,0
2X03 = drill 1.016 octagon: 1 -2.54,-1.27; 2 -2.54,1.27; 3 0,-1.27; 4 0,1.27; 5 2.54,-1.27; 6 2.54,1.27
MSTBVA2 = drill 1.397 long: 1 -2.54,5.08; 2 2.54,5.08
CONV_HLK-20M12 = drill 1.2 square: 1 -25.5,4.5 | drill 1.2: 2 -25.5,-4.5; 3 25.5,13.5; 4 25.5,-13.5
CONV_HLK-10M12 = drill 1.3 square: 1 -21.25,3.9 | drill 1.3: 2 -21.25,-3.9; 3 21.25,11.3; 4 21.25,-11.3
M0805 = smd 1.3 x 1.6: 1 -0.95,0; 2 0.95,0
SOIC127P780X200-16N = smd 1.97 x 0.61: 1 -3.465,4.445; 2 -3.465,3.175; 3 -3.465,1.905; 4 -3.465,0.635; 5 -3.465,-0.635; 6 -3.465,-1.905; 7 -3.465,-3.175; 8 -3.465,-4.445; 9 3.465,-4.445; 10 3.465,-3.175; 11 3.465,-1.905; 12 3.465,-0.635; 13 3.465,0.635; 14 3.465,1.905; 15 3.465,3.175; 16 3.465,4.445
SOIC127P600X175-16N = smd 1.97 x 0.59: 1 -2.475,4.445; 2 -2.475,3.175; 3 -2.475,1.905; 4 -2.475,0.635; 5 -2.475,-0.635; 6 -2.475,-1.905; 7 -2.475,-3.175; 8 -2.475,-4.445; 9 2.475,-4.445; 10 2.475,-3.175; 11 2.475,-1.905; 12 2.475,-0.635; 13 2.475,0.635; 14 2.475,1.905; 15 2.475,3.175; 16 2.475,4.445
SOIC127P600X180-16N = smd 1.31 x 0.62: 1 -2.75,4.445; 2 -2.75,3.175; 3 -2.75,1.905; 4 -2.75,0.635; 5 -2.75,-0.635; 6 -2.75,-1.905; 7 -2.75,-3.175; 8 -2.75,-4.445; 9 2.75,-4.445; 10 2.75,-3.175; 11 2.75,-1.905; 12 2.75,-0.635; 13 2.75,0.635; 14 2.75,1.905; 15 2.75,3.175; 16 2.75,4.445
70543-02 = drill 1.016 long: 1 -1.27,0; 2 1.27,0

### Placement (x,y rotation side)
C1  44.1,59.35 0 top
C2  44.09,65.2 0 top
C5  54.15,52.8 180 top
C6  59.7,52.68 180 top
C7  43.18,52.62 180 top
C8  48.77,52.62 0 top
C9  38.34,118.99 0 top
C10  42.56,118.99 0 top
C11  34.07,118.99 0 top
C12  46.82,118.98 0 top
C15  29.49,119 180 top
C16  25.05,118.98 180 top
C17  96.88,30.16 270 top
C18  96.88,26.16 270 top
C19  108.88,30.16 270 top
C20  96.88,22.16 270 top
C23  108.92,22.23 90 top
C24  108.92,26.36 270 top
C25  79.88,30.16 270 top
C26  79.88,26.16 270 top
C27  91.88,30.16 270 top
C28  79.88,22.16 270 top
C31  91.88,22.16 90 top
C32  91.88,26.16 270 top
C33  63.38,30.16 270 top
C34  63.38,26.16 270 top
C35  74.88,30.16 270 top
C36  63.38,22.16 270 top
C39  74.98,22.1 90 top
C40  74.98,26.1 270 top
C41  46.38,30.16 270 top
C42  46.38,26.16 270 top
C43  57.88,30.16 270 top
C44  46.38,22.16 270 top
C47  57.82,22.1 90 top
C48  57.82,26.36 270 top
D1  50.56,59.21 90 top
D2  55.18,99 0 top
D3  50.59,65.69 90 top
D4  55.17,90.55 0 top
D5  55.17,87.25 0 top
J1  67.55,-0.98 0 top
J2  117.14,9.89 0 top
J5  36.12,141.88 180 top
JP1  67.99,85.18 270 top
MSTBVA1  19.05,1.91 0 top
PS1  20.54,45.75 90 top
PS2  27.39,91.49 0 top
R1  55.19,96.3 0 top
R2  55.2,93.85 180 top
R3  55.17,83.95 180 top
U2  57.5,43.98 0 top
U3  45.99,43.91 0 top
U4  41.72,124.99 90 top
U5  29.97,124.93 90 top
U6  103.38,24.66 0 top
U7  95.88,24.66 0 bottom
U8  86.38,24.66 0 top
U9  78.88,24.66 0 bottom
U10  69.38,24.66 0 top
U11  61.88,24.66 0 bottom
U12  52.25,24.66 0 top
U13  44.88,24.66 0 bottom
X8  67.73,75.12 90 top

### Tracks (layer width: path | path; a pad name or v marks a point on that pad's centre or on a via)
+5V  (via drill 0.35)
  Top 0.2: U6.2 101.62,27.83 104.9,31.11 C19.1 | U8.2 85.11,27.83 88.39,31.11 C27.1 | U10.2 67.97,27.83 71.25,31.11 C35.1 | U12.2 51.08,27.83 54.35,31.11 C43.1
  Top 0.254: C31.1 91.88,20 v91.69,19.81 | C39.1 74.98,20.02 v74.77,19.81 | C47.1 57.82,19.97 v57.66,19.81 | C43.1 57.88,32.54 | 58.17,32.77 74.55,32.77 | 74.55,32.77 91.57,32.77 | 91.57,32.77 108.08,32.77 108.88,31.96 C19.1 | C19.1 | C27.1 91.88,32.45 91.57,32.77 | C35.1 74.88,32.43 74.55,32.77 | C23.1 110,21.23 v110.36,21.59 111.12,22.35 111.12,29.84 109.86,31.11 C19.1 | U5.16 25.52,126.64 v25.72,126.45 | U4.2 38.54,123.53 38.16,123.91 36.13,123.91 v35.88,123.65 35.88,122.13 33.12,119.37 C11.1 33.12,105.56 34.29,104.39 57.15,104.39 58.17,103.38 58.17,96.56 | U3.13 46.64,44.55 | 46.23,52.32 46.23,44.96 46.64,44.55 | 46.23,52.32 45.94,52.62 | C7.1 45.94,52.62 | U2.13 59.78,44.61 59.44,44.96 59.44,46.74 55.02,51.15 C5.1 55.02,53.95 54.36,54.61 50.8,54.61 | 45.94,52.62 46.01,52.62 46.23,52.83 | 46.23,52.83 48.01,54.61 50.29,54.61 | 50.29,54.61 50.55,54.61 | 50.55,54.61 50.8,54.61 | 50.55,54.61 50.56,54.62 50.56,54.85 | 50.56,54.85 D1.C 50.56,58.41 49.61,59.35 C1.+ | 50.8,54.61 50.56,54.85 | 50.56,54.85 50.53,54.85 50.29,54.61 | 46.23,52.32 46.23,52.83 | 46.64,44.55 46.58,44.55 46.23,44.2 46.23,33.27 46.74,32.77 57.66,32.77 | 57.66,32.77 57.88,32.54 | 57.66,32.77 58.17,32.77 | 57.88,32.54 57.94,32.54 58.17,32.77 | JP1.3 66.72,94.82 65.24,96.3 58.42,96.3 | R1.2 57.91,96.3 | 57.91,96.3 58.42,96.3 | 58.17,96.56 57.91,96.3 | 58.17,96.56 58.42,96.3
  Top 0.305: C11.1 C15.1
  Top 0.508: D1.C 50.56,58.43 51.05,58.93 63.25,58.93 64.52,60.2 64.52,80.43 JP1.5
  Bottom 0.254: U7.16 93.7,29.1 95.89,26.92 95.89,19.68 | 95.89,19.68 96.14,19.43 | 96.14,19.43 103.89,19.43 105.79,21.34 110.11,21.34 v110.36,21.59 | U9.16 76.81,29.1 78.87,27.05 78.87,19.68 | 79.13,19.42 91.43,19.42 91.69,19.68 | 78.87,19.68 79.13,19.42 | 74.77,19.68 74.5,19.42 | 62.61,19.43 62.36,19.68 | 62.36,19.68 62.36,26.54 59.8,29.1 U11.16 | 74.5,19.42 62.62,19.42 62.61,19.43 | 57.66,19.68 57.4,19.43 | 57.4,19.43 46.23,19.43 45.34,20.32 45.34,26.92 43.16,29.1 U13.16 | 91.69,19.68 91.94,19.43 95.63,19.43 | v91.69,19.81 91.69,19.68 | 95.63,19.43 96.14,19.43 | 95.89,19.68 95.63,19.43 | v74.77,19.81 74.77,19.68 | 74.77,19.68 75.02,19.43 | 78.87,19.68 78.61,19.43 | 75.02,19.43 78.61,19.43 | 78.61,19.43 78.62,19.42 79.13,19.42 | 74.5,19.42 75.01,19.42 75.02,19.43 | v57.66,19.81 57.66,19.68 | 57.91,19.43 57.66,19.68 | 62.1,19.43 62.36,19.68 | 57.91,19.43 62.1,19.43 | 62.1,19.43 62.61,19.43 | 57.4,19.43 57.91,19.43 | v25.72,126.45 35.37,126.45 35.88,125.94 v35.88,123.65
  Bottom 0.508: JP1.5 JP1.3 JP1.1
+12V  (via drill 0.35)
  Top 0.508: D3.C 49.4,65.2 C2.+ 46.3,68.14 v46.48,68.33
  Bottom 0.508: J5.1 41.76,135.53 46.74,130.56 46.74,68.58 v46.48,68.33
-12
  Top 0.508: C2.- 41.9,101.89 42.8,102.79 | PS2.3 42.8,102.79 | 42.8,102.79 27,102.79 15.75,114.05 15.75,125.98 19.05,129.29 32.26,129.29 34.21,131.24 J5.6
DN2
  Top 0.254: U3.10 53.97,40.73 U2.7
DNN
  Top 0.254: X8.1 67.73,43.6 64.93,40.8 U2.10
DP2
  Top 0.254: U3.11 48.35,42.01 47.5,41.15 47.5,39.12 48.01,38.61 51.56,38.61 52.48,39.53 U2.8
DPP
  Top 0.254: U2.11 64.17,42.07 65.53,43.43 65.53,75.95 66.04,76.45 67.67,76.45 X8.2
GND  (via drill 0.35)  (51 unrouted)
  Top 0.254: U5.1 25.52,123.2 v25.72,123.4
  other vias: 51.05,52.7 47.62,33.91 51.94,52.7 45.34,12.19 62.1,11.94 77.72,11.94 93.73,11.81
  pour Top: 1,-0.03 arc-90 0,0.97 0,145.97 arc-90 1,146.97 71.03,146.97 arc-90 72,146 72,117 arc90 72,117 72,37.97 arc90 73,36.97 134,36.97 arc-90 135,35.97 135,0.97 arc-90 134,-0.03
  pour Bottom: 1,-0.03 arc-90 0,0.97 0,145.97 arc-90 1.01,146.98 71,147 arc-90 72,146 72,117.5 72,37.97 arc90 73,36.97 134,36.97 arc-90 135,35.97 135,0.97 arc-90 134,-0.03
L
  Top 1.27: MSTBVA1.1 16.04,7.46 PS1.1 16.04,29.93 1.66,44.32 1.66,93.1 3.95,95.39 PS2.1
N
  Top 1.27: MSTBVA1.2 21.59,16.8 PS1.2 25.04,25.51 4.57,45.97 4.57,86.03 PS2.2
N$1
  Top 0.508: PS1.4 34.04,66.29 38.35,61.98 49.53,61.98 50.56,60.95 D1.A
N$2
  Top 0.254: D4.+ 53.66,91.63 53.98,91.95 55.63,91.95 56.15,92.47 R2.1
N$3
  Top 0.254: D2.+ 53.67,97.84 54.24,97.27 R1.1
N$4
  Top 0.254: D5.+ 53.66,86.17 53.98,85.85 55.63,85.85 56.13,85.34 56.13,83.96 R3.1
N$8
  Top 0.508: PS2.4 50.59,78.23 D3.A
N$14
  Top 0.254: U4.3 39.81,119.52 C9.2
N$15
  Top 0.254: C9.1 37.39,121.45 37.27,121.56 U4.1
N$16
  Top 0.254: U4.4 41.08,121.74 41.61,121.21 C10.1
N$17
  Top 0.254: U4.5 42.35,121.86 43,121.21 43,120.77 43.51,120.26 C10.2
N$18  (via drill 0.35)
  Top 0.254: v36.01,120.99 36.01,119.98 C11.2 | v37.15,125.94 37.27,126.06 U4.16
  Bottom 0.254: v36.01,120.99 37.03,122.01 37.03,125.82 v37.15,125.94
N$19
  Top 0.254: U4.6 43.62,121.64 45.87,119.39 C12.1
N$27
  Top 0.254: U5.4 29.34,121.99 26.33,118.98 C16.1
N$29
  Top 0.2: C17.2 97.41,29.21 100.06,26.56 U6.3
N$30
  Top 0.2: C17.1 97.67,31.11 99.67,29.1 U6.1
N$31
  Top 0.2: C18.1 98.11,27.11 99.93,25.29 U6.4
N$32
  Top 0.2: C18.2 98.23,25.21 99.42,24.02 U6.5
N$33
  Top 0.2: C19.2 105.96,29.21 U6.16
N$34
  Top 0.2: C20.1 99.32,23.11 99.67,22.75 U6.6
N$39  (via drill 0.35)
  Top 0.2: C24.1 110.16,27.36 v110.36,27.56
  Bottom 0.2: U7.4 100.44,25.29 103.63,22.1 108.58,22.1 110.36,23.88 v110.36,27.56
N$41
  Top 0.2: C25.2 80.27,29.21 82.91,26.56 U8.3
N$42
  Top 0.2: C25.1 80.91,31.11 82.91,29.1 U8.1
N$43
  Top 0.2: C26.1 80.97,27.11 82.78,25.29 U8.4
N$44
  Top 0.2: C26.2 81.34,25.21 82.55,24 83.89,24 U8.5
N$45
  Top 0.2: U8.16 91.78,29.1 C27.2
N$46
  Top 0.2: C28.1 82.3,23.11 82.66,22.75 U8.6
N$49  (via drill 0.35)
  Top 0.2: C32.1 90.95,27.16 v90.55,27.56
  Bottom 0.2: U9.4 83.42,25.29 86.71,22 89.06,22 90.55,23.5 v90.55,27.56
N$51
  Top 0.2: C33.2 66.03,26.56 U10.3
N$52
  Top 0.2: C33.1 63.76,31.11 65.79,29.08 66.89,29.08 U10.1
N$53
  Top 0.2: C34.1 64.08,27.11 65.89,25.29 U10.4
N$55
  Top 0.254: U3.14 47.91,45.81 46.99,46.74 46.99,51.96 47.64,52.62 C8.1
N$56
  Top 0.2: C34.2 64.58,25.21 65.79,24 66.89,24 U10.5
N$57
  Top 0.2: U10.16 74.78,29.1 C35.2
N$58
  Top 0.2: C36.1 63.74,22.75 U10.6
N$61
  Top 0.254: C6.1 62.38,52.68 63.75,51.31 63.75,46.74 62.9,45.88 U2.14
N$62  (via drill 0.35)
  Top 0.2: v73.53,27.3 73.74,27.1 C40.1
  Bottom 0.2: U11.4 66.53,25.29 69.79,22.04 72.2,22.04 73.53,23.37 v73.53,27.3
N$64
  Top 0.2: C41.2 49.03,26.56 U12.3
N$65
  Top 0.2: C41.1 46.87,31.11 48.87,29.1 U12.1
N$66
  Top 0.2: C42.1 46.8,27.11 48.62,25.29 U12.4
N$67
  Top 0.2: C42.2 47.44,25.21 48.64,24 49.76,24 U12.5
N$68
  Top 0.2: U12.16 57.78,29.1 C43.2
N$69
  Top 0.2: C44.1 46.74,22.75 U12.6
N$72  (via drill 0.35)
  Top 0.2: v56.39,27.43 57.74,27.43 C48.1
  Bottom 0.2: U13.4 49.51,25.29 52.83,21.97 54.99,21.97 56.39,23.37 v56.39,27.43
RH-1
  Top 0.254: U4.12 42.35,125.56 41.72,124.92 25.46,124.92 24.45,123.91 24.45,121.8 25.39,120.86 26.99,120.86 28.07,121.94 U5.3
RH-2  (via drill 0.35)
  Top 0.2: U6.12 105.83,24 v103.63,24
  Bottom 0.2: U7.3 101.07,26.56 v103.63,24
RH-3  (via drill 0.35)
  Top 0.2: U8.12 86.76,24.02 v86.74,24
  Bottom 0.2: v86.74,24 84.18,26.56 U9.3
RH-4  (via drill 0.35)
  Top 0.2: U10.12 69.52,24.02 v69.38,24.16
  Bottom 0.2: v69.38,24.16 66.98,26.56 U11.3
RH-5  (via drill 0.35)
  Top 0.2: U12.12 54.71,24 v52.45,24
  Bottom 0.2: v52.45,24 49.89,26.56 U13.3
RX232-1  (via drill 0.35)
  Top 0.254: U4.14 39.81,128.74 36.75,131.8 J5.4 | v44.45,83.95 R3.2
  Bottom 0.254: J5.4 36.75,130.38 44.45,122.68 v44.45,83.95
RX232-2
  Top 0.2: J1.A4 96.03,12.75 104.84,12.75 107.77,15.69 107.77,25.45 106.66,26.56 U6.14
RX232-3
  Top 0.2: U8.14 89.94,26.56 90.73,25.78 90.73,15.66 87.82,12.75 80.28,12.75 J1.B4
RX232-4
  Top 0.2: J1.C4 64.6,12.83 71.25,12.83 73.83,15.4 73.83,25.62 72.88,26.56 U10.14
RX232-5
  Top 0.2: J1.D4 48.9,12.88 55.17,12.88 56.64,14.35 56.64,26.04 56.11,26.56 U12.14
TH-1
  Top 0.254: U5.2 26.8,122.95 28.26,124.41 42.74,124.41 43.62,125.3 U4.11
TH-2  (via drill 0.35)
  Top 0.2: U6.11 104.37,22.75 v104.27,22.86
  Bottom 0.2: v104.27,22.86 104.39,22.99 104.39,24.89 101.45,27.83 U7.2
TH-3  (via drill 0.35)
  Top 0.2: v87.25,22.73 88.83,22.73 U8.11
  Bottom 0.2: U9.2 84.18,27.83 87.47,24.54 87.47,22.96 v87.25,22.73
TH-4  (via drill 0.35)
  Top 0.2: v70.1,22.86 71.75,22.86 U10.11
  Bottom 0.2: v70.1,22.86 70.1,23.85 70.11,23.86 70.11,24.46 66.74,27.83 U11.2
TH-5  (via drill 0.35)
  Top 0.2: v53.21,22.86 53.32,22.75 U12.11
  Bottom 0.2: v53.21,22.86 53.21,24.53 49.91,27.83 U13.2
TX232-1  (via drill 0.35)
  Top 0.254: U4.13 41.08,128.99 38.03,132.04 38.03,133.8 36.3,135.53 J5.5 | R2.2 43.69,93.85 v43.56,93.98
  Bottom 0.254: v43.56,93.98 43.56,122.3 35.48,130.38 J5.5
TX232-2
  Top 0.2: J1.A5 90.68,6.14 89.66,5.12 88.19,5.12 86.33,6.98 86.33,8.86 90.68,13.21 104.65,13.21 107.31,15.88 107.31,24.77 106.79,25.29 U6.13
TX232-3
  Top 0.2: J1.B5 74.93,5.88 74.25,5.2 72.36,5.2 70.36,7.2 70.36,8.89 74.68,13.21 87.63,13.21 90.19,15.77 90.19,24.87 89.77,25.29 U8.13
TX232-4
  Top 0.2: U10.13 72.84,25.29 73.37,24.77 73.37,15.59 71.06,13.28 58.87,13.28 54.69,9.09 54.69,6.66 55.98,5.37 58.42,5.37 59.18,6.14 J1.C5
TX232-5
  Top 0.2: J1.D5 43.43,6.22 42.67,5.46 40.63,5.46 39.05,7.04 39.05,9.46 42.93,13.34 54.98,13.34 56.19,14.54 56.19,25.02 55.91,25.29 U12.13
UN1  (via drill 0.35)
  Top 0.254: U2.1 56.99,48.42 58.8,46.61 58.8,36.58 59.69,35.68 79.77,35.68 81.17,34.29 v94.49,34.29
  Bottom 0.254: U7.6 97.26,22.75 96.39,23.62 96.39,27.13 94.49,29.04 v94.49,34.29
UN2  (via drill 0.35)
  Top 0.254: U2.3 56.61,45.88 57.78,44.7 57.78,35.43 59.18,34.04 78.49,34.04 v78.87,34.42
  Bottom 0.254: v78.87,34.42 78.87,27.77 79.38,27.26 79.38,23.62 80.24,22.75 U9.6
UN3  (via drill 0.35)
  Top 0.254: v55.88,43.05 55.59,43.34 U2.5
  Bottom 0.254: U11.6 63.61,22.75 62.87,23.5 62.87,26.83 55.63,34.07 55.63,42.8 v55.88,43.05
UN4  (via drill 0.35)
  Top 0.254: v44.58,48.26 42.62,48.26 U3.1
  Bottom 0.254: U13.6 46.84,22.75 45.85,23.75 45.85,27.13 44.58,28.4 v44.58,48.26
UN5  (via drill 0.35)
  Top 0.254: U5.6 31.88,120.78 v31.75,120.65 | v40.64,45.97 40.8,45.81 U3.3
  Bottom 0.254: v31.75,120.65 40.64,111.76 v40.64,45.97
UP1  (via drill 0.35)
  Top 0.254: U2.2 56.73,47.15 58.29,45.59 58.29,35.81 58.93,35.18 79.56,35.18 81.21,33.52 v96.01,33.52
  Bottom 0.254: U7.5 97.64,24.02 96.9,24.77 96.9,27.34 96.01,28.23 v96.01,33.52
UP2  (via drill 0.35)
  Top 0.254: U2.4 56.35,44.61 57.15,43.81 57.15,35.18 58.8,33.53 v80.14,33.53
  Bottom 0.254: v80.14,33.53 80.14,24.64 80.75,24.02 U9.5
UP3  (via drill 0.35)
  Top 0.254: U2.6 55.34,42.07 56.38,41.02 v56.38,40.01
  Bottom 0.254: v56.38,40.01 56.38,34.03 63.37,27.04 63.37,24.51 63.86,24.02 U11.5
UP4  (via drill 0.35)
  Top 0.254: U3.2 45.24,47.09 v45.34,46.99
  Bottom 0.254: v45.34,46.99 45.34,28.36 46.35,27.34 46.35,24.64 46.97,24.02 U13.5
UP5  (via drill 0.35)
  Top 0.254: v39.62,44.96 40.04,44.55 U3.4 | v30.48,120.65 30.61,120.78 U5.5
  Bottom 0.254: v30.48,120.65 39.62,111.51 v39.62,44.96

### Text on the board
tNames: PWR | TX | RX